# EAGLE schematic TinyCube05_NoRoutes (EAGLE 7.5.0)
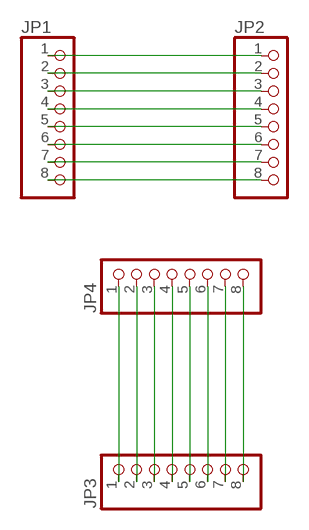
[diagram p0: schematic, sheet 1]

## Parts
JP1  PINHD-1X8BIG  [1X08-BIG]
JP2  PINHD-1X8BIG  [1X08-BIG]
JP3  PINHD-1X8BIG  [1X08-BIG]
JP4  PINHD-1X8BIG  [1X08-BIG]

## Nets
N$1: JP1.2 JP2.2
N$4: JP1.5 JP2.5
N$5: JP1.1 JP2.1
N$6: JP1.3 JP2.3
N$7: JP1.4 JP2.4
N$8: JP1.6 JP2.6
N$9: JP1.7 JP2.7
N$10: JP1.8 JP2.8
N$73: JP3.1 JP4.1
N$74: JP3.2 JP4.2
N$75: JP3.3 JP4.3
N$76: JP3.4 JP4.4
N$77: JP3.5 JP4.5
N$78: JP3.6 JP4.6
N$79: JP3.7 JP4.7
N$80: JP3.8 JP4.8

## Library data of the parts
JP1-JP4 = adafruit:PINHD-1X8: PIN HEADER